# Altium project karmanDB_pcb.PrjPcb (part 2 of 3)

## Sheet karmanDB_power.SchDoc
size A
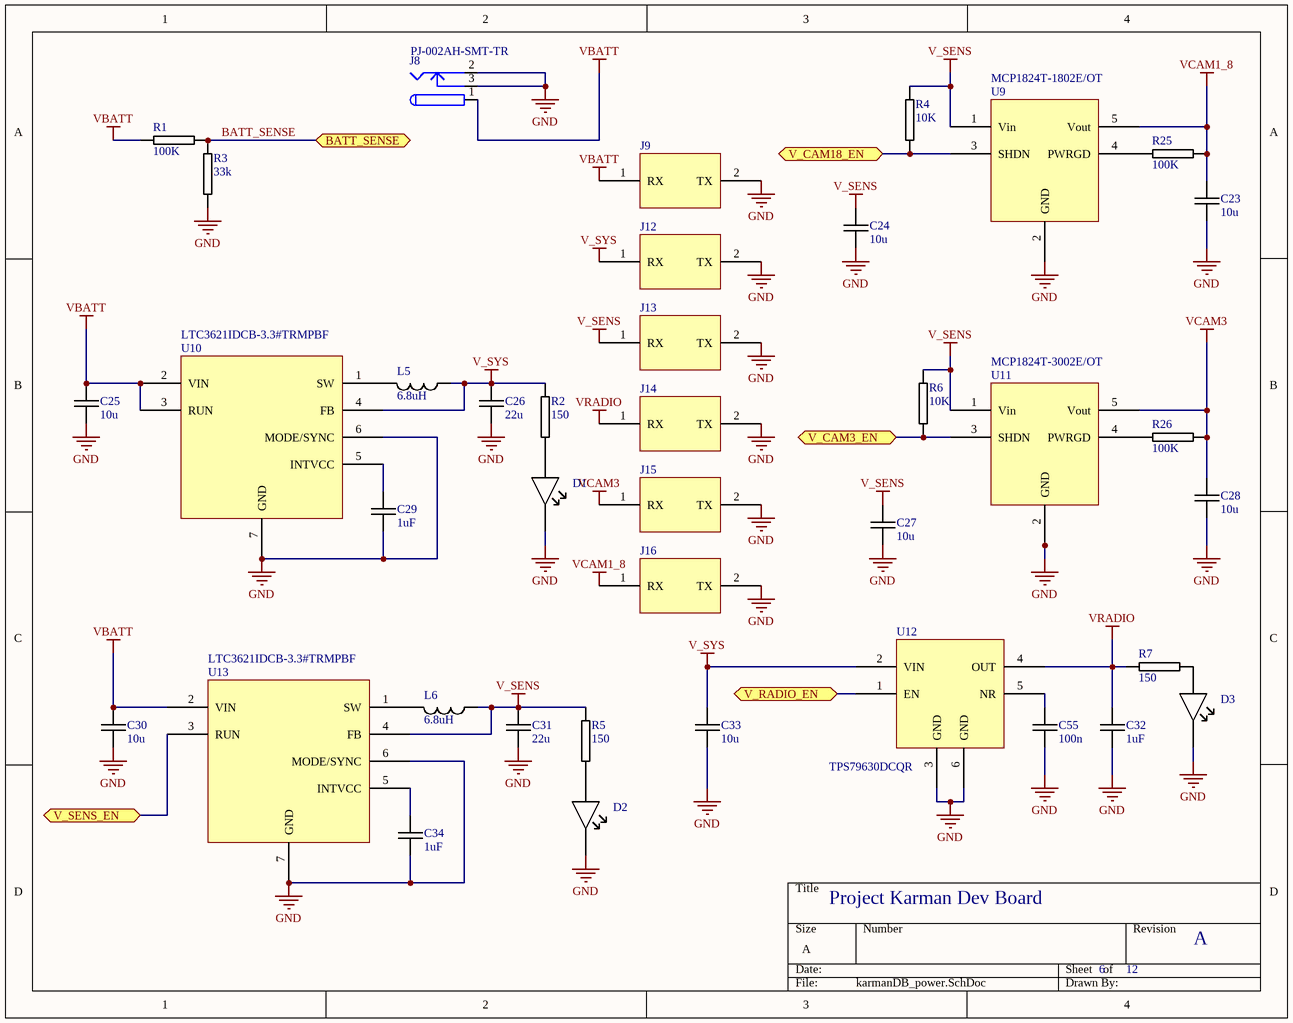
[diagram p4: karmanDB_power.SchDoc]

### Parts
C23  10u  [MURATA_GRM_0603]
C24  10u  [MURATA_GRM_0603]
C25  10u  [MURATA_GRM_0603]
C26  22u  [MURATA_GRM_0603]
C27  10u  [MURATA_GRM_0603]
C28  10u  [MURATA_GRM_0603]
C29  1uF  [MURATA_GRM_0402]
C30  10u  [MURATA_GRM_0603]
C31  22u  [MURATA_GRM_0603]
C32  1uF  [MURATA_GRM_0402]
C33  10u  [MURATA_GRM_0603]
C34  1uF  [MURATA_GRM_0402]
C55  100n  [MURATA_GRM_0603]
D1  LED_LITEON_LTST-C150CKT  [LITEON_LTST-C150]  (value not drawn)
D2  LED_LITEON_LTST-C150CKT  [LITEON_LTST-C150]  (value not drawn)
D3  LED_LITEON_LTST-C150CKT  [LITEON_LTST-C150]  (value not drawn)
J8  PJ-002AH-SMT-TR  [PJ-002AH-SMT]
J9  961102-6404-AR  [3M_961102-6X04]  (value not drawn)
J12  961102-6404-AR  [3M_961102-6X04]  (value not drawn)
J13  961102-6404-AR  [3M_961102-6X04]  (value not drawn)
J14  961102-6404-AR  [3M_961102-6X04]  (value not drawn)
J15  961102-6404-AR  [3M_961102-6X04]  (value not drawn)
J16  961102-6404-AR  [3M_961102-6X04]  (value not drawn)
L5  6.8uH  [TDK_RLF7030]
L6  6.8uH  [TDK_RLF7030]
R1  100K  [PANASONIC_ERJ3R]
R2  150  [PANASONIC_ERJ3R]
R3  33k  [PANASONIC_ERJ2R_SERIES]
R4  10K  [PANASONIC_ERJ3R]
R5  150  [PANASONIC_ERJ3R]
R6  10K  [PANASONIC_ERJ3R]
R7  150  [PANASONIC_ERJ3R]
R25  100K  [PANASONIC_ERJ3R]
R26  100K  [PANASONIC_ERJ3R]
U9  MCP1824T-1802E/OT  [26-27 MCP1824T(-3002E/OT)(-1802E/OT)]
U10  LTC3621IDCB-3.3#TRMPBF  [29 LTC3621IDCB-3.3]
U11  MCP1824T-3002E/OT  [26-27 MCP1824T(-3002E/OT)(-1802E/OT)]
U12  TPS79630DCQR  [TPS79630]
U13  LTC3621IDCB-3.3#TRMPBF  [29 LTC3621IDCB-3.3]

### Ports
BATT_SENSE (bidir), V_CAM3_EN (bidir), V_CAM18_EN (bidir), V_RADIO_EN (bidir), V_SENS_EN (bidir)

### Nets
GND: C23.2 C24.2 C25.2 C26.2 C27.2 C28.2 C29.2 C30.2 C31.2 C32.2 C33.2 C34.2 C55.2 D1.K D2.K D3.K J8.2 J8.3 J9.2(TX) J12.2(TX) J13.2(TX) J14.2(TX) J15.2(TX) J16.2(TX) R3.2 U9.2(GND) U10.6(MODE/SYNC) U10.7(GND) U11.2(GND) U12.3(GND) U12.6(GND) U13.6(MODE/SYNC) U13.7(GND)
V_SENS: C24.1 C27.1 C31.1 J13.1(RX) L6.1 R4.1 R5.1 R6.1 U9.1(Vin) U11.1(Vin) U13.4(FB)
V_SYS: C26.1 C33.1 J12.1(RX) L5.1 R2.2 U10.4(FB) U12.2(VIN)
VBATT: C25.1 C30.1 J8.1 J9.1(RX) R1.1 U10.2(VIN) U10.3(RUN) U13.2(VIN)
VCAM1_8: C23.1 J16.1(RX) R25.2 U9.5(Vout)
VCAM3: C28.1 J15.1(RX) R26.2 U11.5(Vout)
VRADIO: C32.1 J14.1(RX) R7.1 U12.4(OUT)
BATT_SENSE: R1.2 R3.1 ; port BATT_SENSE
V_CAM3_EN: R6.2 U11.3(SHDN) ; port V_CAM3_EN
V_CAM18_EN: R4.2 U9.3(SHDN) ; port V_CAM18_EN
V_RADIO_EN: U12.1(EN) ; port V_RADIO_EN
V_SENS_EN: U13.3(RUN) ; port V_SENS_EN
NetC29_1: C29.1 U10.5(INTVCC)
NetC34_1: C34.1 U13.5(INTVCC)
NetC55_1: C55.1 U12.5(NR)
NetD1_A: D1.A R2.1
NetD2_A: D2.A R5.2
NetD3_A: D3.A R7.2
NetL5_2: L5.2 U10.1(SW)
NetL6_2: L6.2 U13.1(SW)
NetR25_1: R25.1 U9.4(PWRGD)
NetR26_1: R26.1 U11.4(PWRGD)

### Notes on the sheet
- Project Karman Dev Board
- 6
- 12
- A

### Library data of the parts
C23-C25 C27 C28 C30 C33 = CAP_MURATA_GRM188R60J106: CAP CER 10UF 6.3V 20% X5R 0603; Manufacturer: Murata Electronics North America; Manufacturer Part Number: GRM188R60J106ME47J; Capacitance: 10µF; Supplier 1: Digi-Key; Supplier Part Number 1: 490-6405-1-ND; RoHS: RoHS Compliant; Category: Capacitors; Stock 1: 159118; Pricing: 1=0.19, 10=0.128, 50=0.0776, 100=0.0651, 250=0.05272, 500=0.0465, 1000=0.03953, 5000=0.03333 (USD); Packaging: Cut Tape (CT); Tolerance: ±20%; Voltage - Rated: 6.3V; Temperature Coefficient: X5R; Mounting Type: Surface Mount, MLCC; Operating Temperature: -55°C ~ 85°C; Applications: General Purpose; Ratings: -; Package / Case: 0603 (1608 Metric); Size / Dimension: 0.063" L x 0.031" W (1.60mm x 0.80mm); Height - Seated (Max): -; Thickness (Max): 0.035" (0.90mm); Lead Spacing: -; Features: -; Lead Style: -; ComponentLink1URL: http://www.murata.com/~/media/webrenewal/support/library/catalog/products/capacitor/mlcc/c02e.ashx; ComponentLink1Description: http://www.murata.com/~/media/webrenewal/support/library/catalog/products/capacitor/mlcc/c02e.ashx
C26 C31 = CAP_MURATA_GRM188R61A226ME15D: CAP CER 22UF 10V 20% X5R 0603; Manufacturer: Murata Electronics North America; Capacitance: 22µF; Supplier 1: Digi-Key; Supplier Part Number 1: 490-10476-1-ND; Manufacturer Part Number: GRM188R61A226ME15D; RoHS: RoHS Compliant; Category: Capacitors; Stock 1: 2895; Pricing: 1=0.3, 10=0.249, 25=0.1712, 50=0.14, 100=0.1244, 250=0.09332, 500=0.08242, 1000=0.07309 (USD); Packaging: Cut Tape (CT); Tolerance: ±20%; Voltage - Rated: 10V; Temperature Coefficient: X5R; Mounting Type: Surface Mount, MLCC; Operating Temperature: -55°C ~ 85°C; Applications: General Purpose; Ratings: -; Package / Case: 0603 (1608 Metric); Size / Dimension: 0.063" L x 0.031" W (1.60mm x 0.80mm); Height - Seated (Max): -; Thickness (Max): 0.039" (1.00mm); Lead Spacing: -; Features: -; Lead Style: -; ComponentLink1URL: http://www.murata.com/~/media/webrenewal/support/library/catalog/products/capacitor/mlcc/c02e.ashx; ComponentLink1Description: http://www.murata.com/~/media/webrenewal/support/library/catalog/products/capacitor/mlcc/c02e.ashx
C29 C32 C34 = CAP_MURATA_GRM155R61A105KE15D: CAP CER 1uF 10volts X5R 10% 0402; Manufacturer: Murata Electronics; Type: General Purpose MLCC; Voltage Rating DC: 10 V; Supplier 1: Mouser; Manufacturer Part Number: GRM155R61A105KE15D; RoHS: RoHS Compliant; Category: Multilayer Ceramic Capacitors MLCC - SMD/SMT; Stock 1: 726006; Pricing 1: 1=0.528, 10=0.066, 100=0.038, 1000=0.030, 2500=0.026, 10000=0.021, 20000=0.019, 50000=0.016, 100000=0.014 (AUD); Capacitance: 1 uF; Height: 0.5 mm; Length: 1 mm; Package / Case: 0402 (1005 metric); Packaging: Reel; Product: General Type MLCCs; Series: GRM; Termination Style: SMD/SMT; Tolerance: 10 %; Width: 0.5 mm; Brand: Murata Electronics; Case Code - in: 0402; Case Code - mm: 1005; Dielectric: X5R; Maximum Operating Temperature: + 85 C; Minimum Operating Temperature: - 55 C; Product Category: High Capacitance SMD Ceramic Chip Capacitors; Standard Pack Qty: 10000; RoHS - Mouser: Y; Minimum Order Quantity: 1; Reeling: True; ComponentLink1URL: http://www.mouser.com/ds/2/281/c02e-2905.pdf; ComponentLink1Description: http://www.mouser.com/ds/2/281/c02e-2905.pdf; Supplier Part Number 1: 81-GRM155R61A105KE15
C55 = CAP_MURATA_GRM188R70J104KA01D: CAP CER 0.1UF 6.3V 10% X7R 0603; Manufacturer: Murata Electronics North America; Capacitance: 0.1µF; Supplier 1: Digi-Key; Supplier Part Number 1: 490-9730-1-ND; Manufacturer Part Number: GRM188R70J104KA01D; RoHS: RoHS Compliant; Category: Capacitors; Stock 1: 25826; Pricing: 1=0.1, 10=0.061, 50=0.0332, 100=0.0281, 250=0.02296, 500=0.01964, 1000=0.0153 (USD); Packaging: Cut Tape (CT); Tolerance: ±10%; Voltage - Rated: 6.3V; Temperature Coefficient: X7R; Mounting Type: Surface Mount, MLCC; Operating Temperature: -55°C ~ 125°C; Applications: General Purpose; Ratings: -; Package / Case: 0603 (1608 Metric); Size / Dimension: 0.063" L x 0.031" W (1.60mm x 0.80mm); Height - Seated (Max): -; Thickness (Max): 0.035" (0.90mm); Lead Spacing: -; Features: -; Lead Style: -; ComponentLink1URL: http://www.murata.com/~/media/webrenewal/support/library/catalog/products/capacitor/mlcc/c02e.ashx; ComponentLink1Description: http://www.murata.com/~/media/webrenewal/support/library/catalog/products/capacitor/mlcc/c02e.ashx
D1-D3 = LED_LITEON_LTST-C150CKT: LED RED CLEAR 1206 SMD; Manufacturer: Lite-On Inc; Wavelength - Dominant: 638nm; Wavelength - Peak: 660nm; Millicandela Rating: 10mcd; Voltage - Forward (Vf) (Typ): 1.8V; Current - Test: 10mA; Viewing Angle: 130°; Lens Color: Colorless; Lens Style/Size: Rectangle with Flat Top, 2.06mm x 1.60mm; Supplier 1: Digi-Key; Supplier Part Number 1: 160-1167-1-ND; Manufacturer Part Number: LTST-C150CKT; RoHS: RoHS Compliant; Category: Optoelectronics; Stock 1: 90600; Pricing: 1=0.4, 10=0.297, 100=0.1574, 250=0.11136, 500=0.09504, 1000=0.07425 (USD); Packaging: Cut Tape (CT); Color: Red; Lens Transparency: Clear; Package / Case: 1206 (3216 Metric); Supplier Device Package: 1206; Size / Dimension: 3.20mm L x 1.60mm W; Height (Max): 1.10mm; Mounting Type: Surface Mount; ComponentLink1URL: http://optoelectronics.liteon.com/upload/download/DS-22-98-0002/S_110_LTST-C150CKT.pdf; ComponentLink1Description: http://optoelectronics.liteon.com/upload/download/DS-22-98-0002/S_110_LTST-C150CKT.pdf
J8 = PJ-002AH-SMT-TR: CONN POWER JACK 2.1X5.5MM HI CUR; Manufacturer: CUI Inc.; Gender: Male; Plug/Mating Plug Diameter: 2.1mm ID, 5.5mm OD; Number of Positions/Contacts: 2 Conductors, 3 Contacts; Internal Switch(s): Single Switch, Normally Closed; Shielding: Unshielded; Voltage - Rated: 24VDC; Current Rating: 5A; Supplier 1: Digi-Key; Manufacturer Part Number: PJ-002AH-SMT-TR; RoHS: RoHS Compliant; Category: Connectors, Interconnects; Stock 1: 15720; Pricing 1: 1=1.89, 10=1.469, 100=1.121 (USD); Connector Type: Jack; Mounting Type: Surface Mount; Termination: Solder; Features: -; Color: Black; Contact Material: Copper Alloy; Contact Material - Plating: Nickel; Housing Color: Black; Housing Material: Thermoplastic; Operating Temperature: -25°C ~ 85°C; ComponentLink1URL: http://www.cui.com/product/resource/digikeypdf/pj-002ah-smt.pdf; ComponentLink1Description: http://www.cui.com/product/resource/digikeypdf/pj-002ah-smt.pdf; Supplier Part Number 1: CP-002AHPJCT-ND
J9 J12-J16 = 961102-6404-AR: CONN HEADER VERT SGL 2POS GOLD; Manufacturer: 3M; Connector Type: Header, Unshrouded; Number of Positions: 2; Number of Positions Loaded: All; Pitch: 0.100" (2.54mm); Supplier 1: Digi-Key; Manufacturer Part Number: 961102-6404-AR; RoHS: RoHS Compliant; Category: Connectors, Interconnects; Stock 1: 60000; Pricing 1: 1=0.16, 10=0.15, 25=0.128, 50=0.112, 100=0.104, 250=0.092, 500=0.088, 1000=0.072, 2500=0.066 (USD); Packaging: Bulk; Contact Type: Male Pin; Number of Rows: 1; Row Spacing: -; Contact Mating Length: 0.217" (5.50mm); Mounting Type: Through Hole; Termination: Solder; Fastening Type: -; Features: -; Contact Finish: Gold; Contact Finish Thickness: Flash; Color: Black; ComponentLink1URL: http://multimedia.3m.com/mws/mediawebserver?66666UuZjcFSLXTtNxTElX&VEVuQEcuZgVs6EVs6E666666--; ComponentLink1Description: http://multimedia.3m.com/mws/mediawebserver?66666UuZjcFSLXTtNxTElX&VEVuQEcuZgVs6EVs6E666666--; Supplier Part Number 1: 3M9447-ND
L5 L6 = TDK_IND_RLF7030T-6R8M2R8: FIXED IND 6.8UH 2.8A 37.3 MOHM; Manufacturer: TDK Corporation; Type: Wirewound; Material - Core: Ferrite; Inductance: 6.8µH; Tolerance: ±20%; Current - Saturation: 3A; Shielding: Shielded; DC Resistance (DCR): 44.76 mOhm Max; Frequency - Test: 100kHz; Supplier 1: Digi-Key; Manufacturer Part Number: RLF7030T-6R8M2R8; RoHS: RoHS Compliant; Category: Inductors, Coils, Chokes; Stock 1: 8675; Pricing 1: 1=2.31, 10=2.153, 50=1.7528, 100=1.599, 500=1.353 (USD); Packaging: Cut Tape (CT); Current Rating: 2.8A; Q @ Freq: -; Frequency - Self Resonant: -; Operating Temperature: -40°C ~ 125°C; Mounting Type: Surface Mount; Package / Case: Nonstandard; Size / Dimension: 0.287" L x 0.268" W (7.30mm x 6.80mm); Height - Seated (Max): 0.126" (3.20mm); Supplier Device Package: -; ComponentLink1URL: http://product.tdk.com/inductor/ind/en/documents/inductor_commercial_power_rlf_en.pdf; ComponentLink1Description: http://product.tdk.com/inductor/ind/en/documents/inductor_commercial_power_rlf_en.pdf; Supplier Part Number 1: 445-2965-1-ND
R1 R25 R26 = RES_PANASONIC_ERJ-3GEYJ104V: RES SMD 100K OHM 5% 1/10W 0603; Manufacturer: Panasonic Electronic Components; Power (Watts): 0.1W, 1/10W; Temperature Coefficient: ±200ppm/°C; Supplier 1: Digi-Key; Supplier Part Number 1: P100KGCT-ND; Manufacturer Part Number: ERJ-3GEYJ104V; RoHS: RoHS Compliant; Category: Resistors; Stock 1: 1746081; Pricing: 1=0.1, 50=0.0096, 100=0.0071, 250=0.00544, 500=0.00436, 1000=0.00321 (USD); Packaging: Cut Tape (CT); Resistance (Ohms): 100k; Tolerance: ±5%; Composition: Thick Film; Features: Automotive AEC-Q200; Operating Temperature: -55°C ~ 155°C; Package / Case: 0603 (1608 Metric); Supplier Device Package: 0603; Size / Dimension: 0.063" L x 0.031" W (1.60mm x 0.80mm); Height: 0.022" (0.55mm); Number of Terminations: 2; ComponentLink1URL: http://industrial.panasonic.com/www-cgi/jvcr13pz.cgi?E+PZ+3+AOA0001+ERJ3GEYJ104V+7+WW; ComponentLink1Description: http://industrial.panasonic.com/www-cgi/jvcr13pz.cgi?E+PZ+3+AOA0001+ERJ3GEYJ104V+7+WW
R2 R5 R7 = RES_PANASONIC_ERJ-3GEYJ151V: RES SMD 150 OHM 5% 1/10W 0603; Manufacturer: Panasonic Electronic Components; Power (Watts): 0.1W, 1/10W; Temperature Coefficient: ±200ppm/°C; Supplier 1: Digi-Key; Supplier Part Number 1: P150GCT-ND; Manufacturer Part Number: ERJ-3GEYJ151V; RoHS: RoHS Compliant; Category: Resistors; Stock 1: 236723; Pricing: 1=0.1, 50=0.0096, 100=0.0071, 250=0.00544, 500=0.00436, 1000=0.00321 (USD); Packaging: Cut Tape (CT); Resistance (Ohms): 150; Tolerance: ±5%; Composition: Thick Film; Features: Automotive AEC-Q200; Operating Temperature: -55°C ~ 155°C; Package / Case: 0603 (1608 Metric); Supplier Device Package: 0603; Size / Dimension: 0.063" L x 0.031" W (1.60mm x 0.80mm); Height: 0.022" (0.55mm); Number of Terminations: 2; ComponentLink1URL: http://industrial.panasonic.com/www-cgi/jvcr13pz.cgi?E+PZ+3+AOA0001+ERJ3GEYJ151V+7+WW; ComponentLink1Description: http://industrial.panasonic.com/www-cgi/jvcr13pz.cgi?E+PZ+3+AOA0001+ERJ3GEYJ151V+7+WW
R3 = RES_PANASONIC_ERJ-2GEJ333X: RES SMD 33K OHM 5% 1/10W 0402; Manufacturer: Panasonic Electronic Components; Power (Watts): 0.1W, 1/10W; Temperature Coefficient: ±200ppm/°C; Supplier 1: Digi-Key; Manufacturer Part Number: ERJ-2GEJ333X; RoHS: RoHS Compliant; Category: Resistors; Stock 1: 860000; Pricing 1: 10000=0.00198, 30000=0.00174, 50000=0.0016, 100000=0.00156 (USD); Packaging: Tape & Reel (TR); Resistance (Ohms): 33k; Tolerance: ±5%; Composition: Thick Film; Features: Automotive AEC-Q200; Operating Temperature: -55°C ~ 155°C; Package / Case: 0402 (1005 Metric); Supplier Device Package: 0402; Size / Dimension: 0.039" L x 0.020" W (1.00mm x 0.50mm); Height: 0.016" (0.40mm); Number of Terminations: 2; ComponentLink1URL: http://industrial.panasonic.com/www-cgi/jvcr13pz.cgi?E+PZ+3+AOA0001+ERJ2GEJ333X+7+WW; ComponentLink1Description: http://industrial.panasonic.com/www-cgi/jvcr13pz.cgi?E+PZ+3+AOA0001+ERJ2GEJ333X+7+WW; Supplier Part Number 1: P33KJTR-ND
R4 R6 = RES_PANASONIC_ERJ-3GEYJ103V: RES SMD 10K OHM 5% 1/10W 0603; Manufacturer: Panasonic Electronic Components; Power (Watts): 0.1W, 1/10W; Temperature Coefficient: ±200ppm/°C; Supplier 1: Digi-Key; Supplier Part Number 1: P10KGCT-ND; Manufacturer Part Number: ERJ-3GEYJ103V; RoHS: RoHS Compliant; Category: Resistors; Stock 1: 4229597; Pricing: 1=0.1, 50=0.0096, 100=0.0071, 250=0.00544, 500=0.00436, 1000=0.00321 (USD); Packaging: Cut Tape (CT); Resistance (Ohms): 10k; Tolerance: ±5%; Composition: Thick Film; Features: Automotive AEC-Q200; Operating Temperature: -55°C ~ 155°C; Package / Case: 0603 (1608 Metric); Supplier Device Package: 0603; Size / Dimension: 0.063" L x 0.031" W (1.60mm x 0.80mm); Height: 0.022" (0.55mm); Number of Terminations: 2; ComponentLink1URL: http://industrial.panasonic.com/www-cgi/jvcr13pz.cgi?E+PZ+3+AOA0001+ERJ3GEYJ103V+7+WW; ComponentLink1Description: http://industrial.panasonic.com/www-cgi/jvcr13pz.cgi?E+PZ+3+AOA0001+ERJ3GEYJ103V+7+WW
U9 = MCP1824T-1802E/OT: IC REG LDO 1.8V 0.3A SOT23-5; Manufacturer: Microchip Technology; Regulator Topology: Positive Fixed; Current - Output: 300mA; Voltage - Dropout (Typical): 0.2V @ 300mA; Number of Regulators: 1; Voltage - Input: 2.1 V ~ 6 V; Supplier 1: Digi-Key; Manufacturer Part Number: MCP1824T-1802E/OT; RoHS: RoHS Compliant; Category: Integrated Circuits (ICs); Stock 1: 10644; Pricing 1: 1=0.5, 10=0.42, 25=0.35, 100=0.32 (USD); Packaging: Cut Tape (CT); Voltage - Output: 1.8V; Current - Limit (Min): -; Operating Temperature: -40°C ~ 125°C; Mounting Type: Surface Mount; Package / Case: SC-74A, SOT-753; Supplier Device Package: SOT-23-5; ComponentLink1URL: http://www.microchip.com/mymicrochip/filehandler.aspx?ddocname=en533257; ComponentLink1Description: http://www.microchip.com/mymicrochip/filehandler.aspx?ddocname=en533257; Supplier Part Number 1: MCP1824T-1802E/OTCT-ND
U10 U13 = LTC3621IDCB-3.3#TRMPBF: IC REG BUCK 3.3V 1A SYNC 6DFN; Manufacturer: Linear Technology; Function: Step-Down; Output Configuration: Positive; Output Type: Fixed; Number of Outputs: 1; Voltage - Input (Min): 2.7V; Voltage - Input (Max): 17V; Frequency - Switching: 1MHz; Synchronous Rectifier: Yes; Supplier 1: Digi-Key; Manufacturer Part Number: LTC3621IDCB-3.3#TRMPBF; RoHS: RoHS Compliant; Category: Integrated Circuits (ICs); Stock 1: 490; Pricing 1: 1=6.84, 25=6.1052, 100=5.4948 (USD); Packaging: Cut Tape (CT); Topology: Buck; Voltage - Output (Min/Fixed): 3.3V; Voltage - Output (Max): -; Current - Output: 1A; Operating Temperature: -40°C ~ 125°C (TJ); Mounting Type: Surface Mount; Package / Case: 6-WFDFN Exposed Pad; Supplier Device Package: 6-DFN (2x3); ComponentLink1URL: http://www.linear.com/docs/42954; ComponentLink1Description: http://www.linear.com/docs/42954; Supplier Part Number 1: LTC3621IDCB-3.3#TRMPBFCT-ND
U11 = MCP1824T-3002E/OT: IC REG LDO 3V 0.3A SOT23-5; Manufacturer: Microchip Technology; Regulator Topology: Positive Fixed; Current - Output: 300mA; Voltage - Dropout (Typical): 0.2V @ 300mA; Number of Regulators: 1; Voltage - Input: Up to 6V; Supplier 1: Digi-Key; Manufacturer Part Number: MCP1824T-3002E/OT; RoHS: RoHS Compliant; Category: Integrated Circuits (ICs); Stock 1: 1155; Pricing 1: 1=0.5, 10=0.42, 25=0.35, 100=0.32 (USD); Packaging: Cut Tape (CT); Voltage - Output: 3V; Current - Limit (Min): -; Operating Temperature: -40°C ~ 125°C; Mounting Type: Surface Mount; Package / Case: SC-74A, SOT-753; Supplier Device Package: SOT-23-5; ComponentLink1URL: http://www.microchip.com/mymicrochip/filehandler.aspx?ddocname=en533257; ComponentLink1Description: http://www.microchip.com/mymicrochip/filehandler.aspx?ddocname=en533257; Supplier Part Number 1: MCP1824T-3002E/OTCT-ND
U12 = TPS79630DCQR: IC REG LDO 3V 1A SOT223-6; Manufacturer: Texas Instruments; Regulator Topology: Positive Fixed; Voltage - Dropout (Typical): 0.25V @ 1A; Number of Regulators: 1; Voltage - Input: Up to 5.5V; Current - Limit (Min): 2.4A; Supplier 1: Digi-Key; Manufacturer Part Number: TPS79630DCQR; RoHS: RoHS Compliant; Category: Integrated Circuits (ICs); Stock 1: 4641; Pricing 1: 1=3.13, 10=2.825, 25=2.5308, 100=2.2759, 250=2.02088, 500=1.7658, 750=1.59903, 1000=1.22625 (USD); Packaging: Cut Tape (CT); Voltage - Output: 3V; Current - Output: 1A; Operating Temperature: -40°C ~ 125°C; Mounting Type: Surface Mount; Package / Case: SOT-223-6; Supplier Device Package: SOT-223-6; ComponentLink1URL: http://www.ti.com/lit/ds/symlink/tps796.pdf; ComponentLink1Description: http://www.ti.com/lit/ds/symlink/tps796.pdf; Supplier Part Number 1: 296-13765-1-ND

## Sheet karmanDB_transceiver.SchDoc
size A
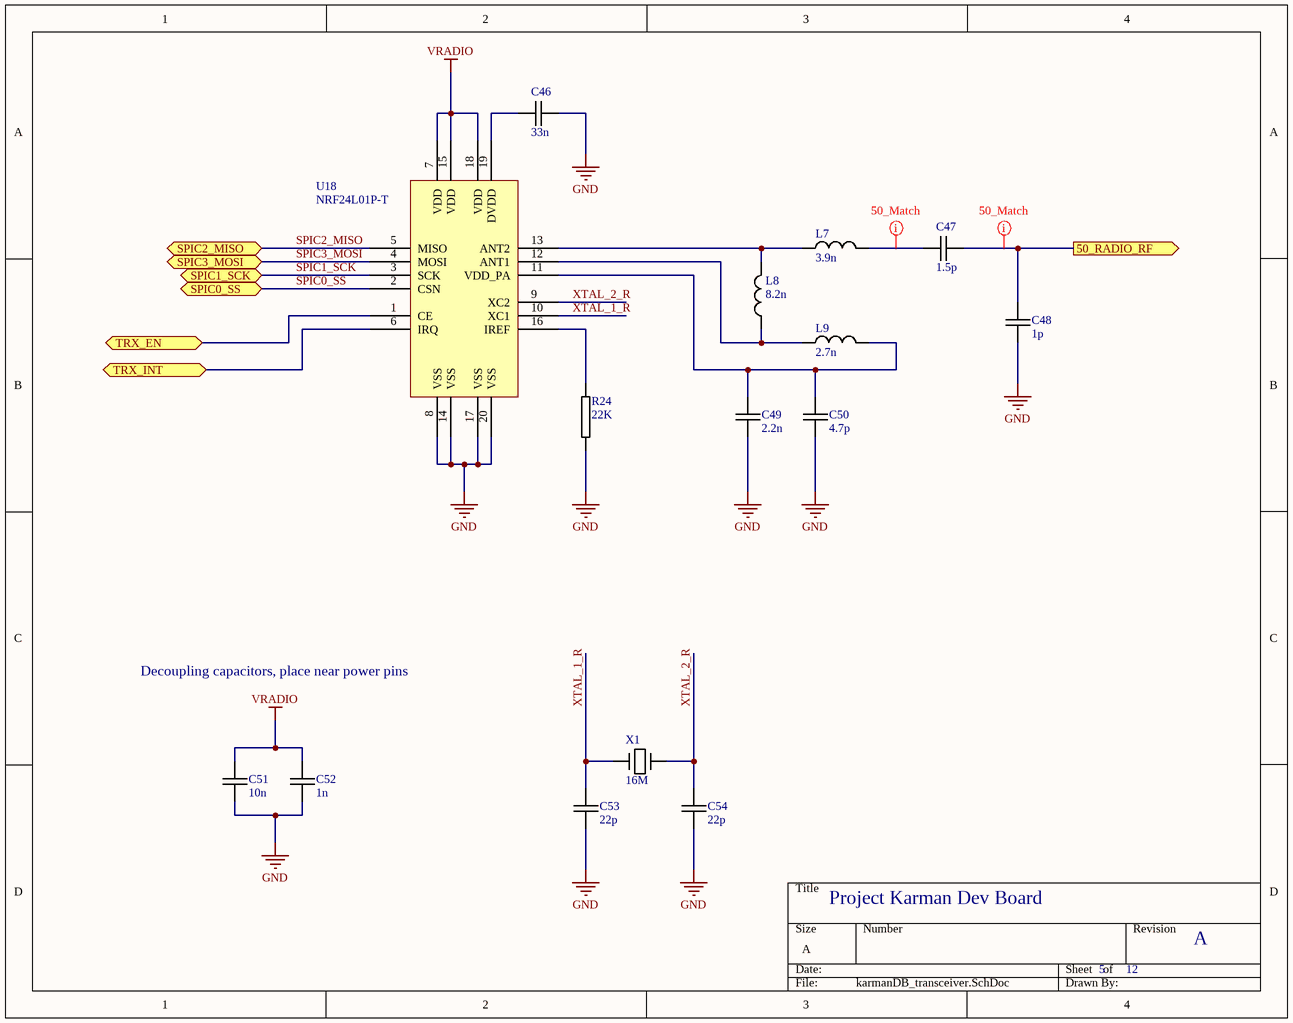
[diagram p5: karmanDB_transceiver.SchDoc]

### Parts
C46  33n  [MURATA_GRM_0603]
C47  1.5p  [MURATA_GRM_0402]
C48  1p  [MURATA_GRM_0402]
C49  2.2n  [MURATA_GRM_0402]
C50  4.7p  [MURATA_GRM_0402]
C51  10n  [MURATA_GRM_0603]
C52  1n  [MURATA_GRM_0603]
C53  22p  [MURATA_GRM_0603]
C54  22p  [MURATA_GRM_0603]
L7  3.9n  [PANASONIC_ELJRF]
L8  8.2n  [PANASONIC_ELJRF]
L9  2.7n  [PANASONIC_ELJRF]
R24  22K  [PANASONIC_ERJ3R]
U18  Manufacturer Part Number: NRF24L01P-T  [NORDIC_nRF24L01P]  (hidden comment: NORDIC_NRF24L01P)
X1  16M  [TXC_7B_SERIES]

### Ports
50_RADIO_RF (out), SPIC0_SS (bidir), SPIC1_SCK (bidir), SPIC2_MISO (bidir), SPIC3_MOSI (bidir), TRX_EN (bidir), TRX_INT (bidir)

### Nets
GND: C46.2 C48.2 C49.2 C50.2 C51.2 C52.2 C53.2 C54.2 R24.2 U18.8(VSS) U18.14(VSS) U18.17(VSS) U18.20(VSS) X1.PAD
VRADIO: C51.1 C52.1 U18.7(VDD) U18.15(VDD) U18.18(VDD)
SPIC0_SS: U18.2(CSN) ; port SPIC0_SS
SPIC1_SCK: U18.3(SCK) ; port SPIC1_SCK
SPIC2_MISO: U18.5(MISO) ; port SPIC2_MISO
SPIC3_MOSI: U18.4(MOSI) ; port SPIC3_MOSI
TRX_EN: U18.1(CE) ; port TRX_EN
TRX_INT: U18.6(IRQ) ; port TRX_INT
XTAL_1_R: C53.1 U18.10(XC1) X1.XTAL_P
XTAL_2_R: C54.1 U18.9(XC2) X1.XTAL_N
NetC46_1: C46.1 U18.19(DVDD)
NetC47_1: C47.1 L7.2
NetC47_2: C47.2 C48.1 ; port 50_RADIO_RF
NetC49_1: C49.1 C50.1 L9.2 U18.11(VDD_PA)
NetL7_1: L7.1 L8.2 U18.13(ANT2)
NetL8_1: L8.1 L9.1 U18.12(ANT1)
NetR24_1: R24.1 U18.16(IREF)

### Layout directives
net class 50_Match_Class: NetC47_1, NetC47_2

### Notes on the sheet
- Decoupling capacitors, place near power pins
- Project Karman Dev Board
- 5
- 12
- A

### Library data of the parts
C46 = CAP_MURATA_GRM188R71C333KA01D: CAP CER 0.033UF 16V 10% X7R 0603; Manufacturer: Murata Electronics North America; Capacitance: 0.033µF; Supplier 1: Digi-Key; Supplier Part Number 1: 490-1528-1-ND; Manufacturer Part Number: GRM188R71C333KA01D; RoHS: RoHS Compliant; Category: Capacitors; Stock 1: 112656; Pricing: 1=0.1, 10=0.054, 50=0.0292, 100=0.0248, 250=0.02024, 500=0.01732, 1000=0.0135 (USD); Packaging: Cut Tape (CT); Tolerance: ±10%; Voltage - Rated: 16V; Temperature Coefficient: X7R; Mounting Type: Surface Mount, MLCC; Operating Temperature: -55°C ~ 125°C; Applications: General Purpose; Ratings: -; Package / Case: 0603 (1608 Metric); Size / Dimension: 0.063" L x 0.031" W (1.60mm x 0.80mm); Height - Seated (Max): -; Thickness (Max): 0.035" (0.90mm); Lead Spacing: -; Features: -; Lead Style: -; ComponentLink1URL: http://www.murata.com/~/media/webrenewal/support/library/catalog/products/capacitor/mlcc/c02e.ashx; ComponentLink1Description: http://www.murata.com/~/media/webrenewal/support/library/catalog/products/capacitor/mlcc/c02e.ashx
C47 = CAP_MURATA_GJM1555C1H1R5BB01D: CAP CER 1.5PF 50V NP0 0402; Manufacturer: Murata Electronics North America; Tolerance: ±0.1pF; Temperature Coefficient: C0G, NP0; Supplier 1: Digi-Key; Supplier Part Number 1: 490-8087-1-ND; Manufacturer Part Number: GJM1555C1H1R5BB01D; RoHS: RoHS Compliant; Category: Capacitors; Stock 1: 3662; Pricing: 1=0.2, 10=0.14, 50=0.0804, 100=0.0664, 250=0.05588, 500=0.04682, 1000=0.03768, 5000=0.03185 (USD); Packaging: Cut Tape (CT); Capacitance: 1.5pF; Voltage - Rated: 50V; Mounting Type: Surface Mount, MLCC; Operating Temperature: -55°C ~ 125°C; Applications: RF, Microwave, High Frequency; Ratings: -; Package / Case: 0402 (1005 Metric); Size / Dimension: 0.039" L x 0.020" W (1.00mm x 0.50mm); Height - Seated (Max): -; Thickness (Max): 0.022" (0.55mm); Lead Spacing: -; Features: High Q, Low Loss; Lead Style: -; ComponentLink1URL: http://www.murata.com/~/media/webrenewal/support/library/catalog/products/capacitor/mlcc/c02e.ashx; ComponentLink1Description: http://www.murata.com/~/media/webrenewal/support/library/catalog/products/capacitor/mlcc/c02e.ashx
C48 = CAP_MURATA_GJM1555C1H1R0BB01D: CAP CER 1PF 50V NP0 0402; Manufacturer: Murata Electronics North America; Tolerance: ±0.1pF; Temperature Coefficient: C0G, NP0; Supplier 1: Digi-Key; Supplier Part Number 1: 490-6073-1-ND; Manufacturer Part Number: GJM1555C1H1R0BB01D; RoHS: RoHS Compliant; Category: Capacitors; Stock 1: 74934; Pricing: 1=0.2, 10=0.14, 25=0.1048, 50=0.0804, 100=0.0664, 250=0.05588, 500=0.04682, 1000=0.03768, 5000=0.03185 (USD); Packaging: Cut Tape (CT); Capacitance: 1pF; Voltage - Rated: 50V; Mounting Type: Surface Mount, MLCC; Operating Temperature: -55°C ~ 125°C; Applications: RF, Microwave, High Frequency; Ratings: -; Package / Case: 0402 (1005 Metric); Size / Dimension: 0.039" L x 0.020" W (1.00mm x 0.50mm); Height - Seated (Max): -; Thickness (Max): 0.022" (0.55mm); Lead Spacing: -; Features: High Q, Low Loss; Lead Style: -; ComponentLink1URL: http://www.murata.com/~/media/webrenewal/support/library/catalog/products/capacitor/mlcc/c02e.ashx; ComponentLink1Description: http://www.murata.com/~/media/webrenewal/support/library/catalog/products/capacitor/mlcc/c02e.ashx
C49 = MURATA_GRM155R71C222KA01D: CAP CER 2200PF 16V 10% X7R 0402; Manufacturer: Murata Electronics North America; Supplier 1: Digi-Key; Supplier Part Number 1: 490-6330-1-ND; Manufacturer Part Number: GRM155R71C222KA01D; RoHS: RoHS Compliant; Category: Capacitors; Stock 1: 28283; Pricing: 1=0.1, 10=0.023, 25=0.016, 50=0.0124, 100=0.0105, 250=0.00856, 500=0.00732, 1000=0.0057, 5000=0.00475 (USD); Packaging: Cut Tape (CT); Capacitance: 2200pF; Tolerance: ±10%; Voltage - Rated: 16V; Temperature Coefficient: X7R; Mounting Type: Surface Mount, MLCC; Operating Temperature: -55°C ~ 125°C; Applications: General Purpose; Ratings: -; Package / Case: 0402 (1005 Metric); Size / Dimension: 0.039" L x 0.020" W (1.00mm x 0.50mm); Height - Seated (Max): -; Thickness (Max): 0.022" (0.55mm); Lead Spacing: -; Features: -; Lead Style: *; ComponentLink1URL: http://www.murata.com/~/media/webrenewal/support/library/catalog/products/capacitor/mlcc/c02e.ashx; ComponentLink1Description: http://www.murata.com/~/media/webrenewal/support/library/catalog/products/capacitor/mlcc/c02e.ashx
C50 = MURATA_GRM1555C1H4R7CA01D: CAP CER 4.7PF 50V NP0 0402; Manufacturer: Murata Electronics North America; Tolerance: ±0.25pF; Temperature Coefficient: C0G, NP0; Supplier 1: Digi-Key; Supplier Part Number 1: 490-5874-1-ND; Manufacturer Part Number: GRM1555C1H4R7CA01D; RoHS: RoHS Compliant; Category: Capacitors; Stock 1: 317555; Pricing: 1=0.1, 10=0.021, 50=0.0114, 100=0.0096, 250=0.00788, 500=0.00674, 1000=0.00525, 5000=0.00438 (USD); Packaging: Cut Tape (CT); Capacitance: 4.7pF; Voltage - Rated: 50V; Mounting Type: Surface Mount, MLCC; Operating Temperature: -55°C ~ 125°C; Applications: General Purpose; Ratings: -; Package / Case: 0402 (1005 Metric); Size / Dimension: 0.039" L x 0.020" W (1.00mm x 0.50mm); Height - Seated (Max): -; Thickness (Max): 0.022" (0.55mm); Lead Spacing: -; Features: -; Lead Style: -; ComponentLink1URL: http://www.murata.com/~/media/webrenewal/support/library/catalog/products/capacitor/mlcc/c02e.ashx; ComponentLink1Description: http://www.murata.com/~/media/webrenewal/support/library/catalog/products/capacitor/mlcc/c02e.ashx
C51 = CAP_MURATA_GRM188R71H103MA01D: CAP CER 10000PF 50V 20% X7R 0603; Manufacturer: Murata Electronics North America; Supplier 1: Digi-Key; Supplier Part Number 1: 490-1511-1-ND; Manufacturer Part Number: GRM188R71H103MA01D; RoHS: RoHS Compliant; Category: Capacitors; Stock 1: 188245; Pricing: 1=0.1, 10=0.018, 50=0.0098, 100=0.0083, 250=0.00676, 500=0.00578, 1000=0.0045 (USD); Packaging: Cut Tape (CT); Capacitance: 10000pF; Tolerance: ±20%; Voltage - Rated: 50V; Temperature Coefficient: X7R; Mounting Type: Surface Mount, MLCC; Operating Temperature: -55°C ~ 125°C; Applications: General Purpose; Ratings: -; Package / Case: 0603 (1608 Metric); Size / Dimension: 0.063" L x 0.031" W (1.60mm x 0.80mm); Height - Seated (Max): -; Thickness (Max): 0.035" (0.90mm); Lead Spacing: -; Features: -; Lead Style: -; ComponentLink1URL: http://www.murata.com/~/media/webrenewal/support/library/catalog/products/capacitor/mlcc/c02e.ashx; ComponentLink1Description: http://www.murata.com/~/media/webrenewal/support/library/catalog/products/capacitor/mlcc/c02e.ashx
C52 = CAP_MURATA_GRM188R71H102KA01D: CAP CER 1000PF 50V 10% X7R 0603; Manufacturer: Murata Electronics North America; Supplier 1: Digi-Key; Supplier Part Number 1: 490-1494-1-ND; Manufacturer Part Number: GRM188R71H102KA01D; RoHS: RoHS Compliant; Category: Capacitors; Stock 1: 1211591; Pricing: 1=0.1, 10=0.02, 50=0.0108, 100=0.0091, 250=0.00744, 500=0.00636, 1000=0.00495 (USD); Packaging: Cut Tape (CT); Capacitance: 1000pF; Tolerance: ±10%; Voltage - Rated: 50V; Temperature Coefficient: X7R; Mounting Type: Surface Mount, MLCC; Operating Temperature: -55°C ~ 125°C; Applications: General Purpose; Ratings: -; Package / Case: 0603 (1608 Metric); Size / Dimension: 0.063" L x 0.031" W (1.60mm x 0.80mm); Height - Seated (Max): -; Thickness (Max): 0.035" (0.90mm); Lead Spacing: -; Features: -; Lead Style: -; ComponentLink1URL: http://www.murata.com/~/media/webrenewal/support/library/catalog/products/capacitor/mlcc/c02e.ashx; ComponentLink1Description: http://www.murata.com/~/media/webrenewal/support/library/catalog/products/capacitor/mlcc/c02e.ashx
C53 C54 = CAP_MURATA_GRM1885C1H220JA01D: CAP CER 22PF 50V 5% NP0 0603; Manufacturer: Murata Electronics North America; Temperature Coefficient: C0G, NP0; Supplier 1: Digi-Key; Supplier Part Number 1: 490-1411-1-ND; Manufacturer Part Number: GRM1885C1H220JA01D; RoHS: RoHS Compliant; Category: Capacitors; Stock 1: 287854; Pricing: 1=0.1, 10=0.041, 50=0.0222, 100=0.0188, 250=0.0154, 500=0.01316, 1000=0.01026 (USD); Packaging: Cut Tape (CT); Capacitance: 22pF; Tolerance: ±5%; Voltage - Rated: 50V; Mounting Type: Surface Mount, MLCC; Operating Temperature: -55°C ~ 125°C; Applications: General Purpose; Ratings: -; Package / Case: 0603 (1608 Metric); Size / Dimension: 0.063" L x 0.031" W (1.60mm x 0.80mm); Height - Seated (Max): -; Thickness (Max): 0.035" (0.90mm); Lead Spacing: -; Features: -; Lead Style: -; ComponentLink1URL: http://www.murata.com/~/media/webrenewal/support/library/catalog/products/capacitor/mlcc/c02e.ashx; ComponentLink1Description: http://www.murata.com/~/media/webrenewal/support/library/catalog/products/capacitor/mlcc/c02e.ashx
L7 = PANASONIC_ELJ-RF3N9DFB: FIXED IND 3.9NH 360MA 150 MOHM; Manufacturer: Panasonic Electronic Components; Type: Multilayer; Material - Core: Non-Magnetic; Tolerance: ±0.3nH; Shielding: Unshielded; DC Resistance (DCR): 150 mOhm Max; Q @ Freq: 8 @ 100MHz; Frequency - Self Resonant: 5.2GHz; Frequency - Test: 100MHz; Supplier 1: Digi-Key; Supplier Part Number 1: PCD1930CT-ND; Manufacturer Part Number: ELJ-RF3N9DFB; RoHS: RoHS Compliant; Category: Inductors, Coils, Chokes; Stock 1: 11359; Pricing: 1=0.08, 10=0.074, 50=0.0698, 100=0.0651, 500=0.05116 (USD); Packaging: Cut Tape (CT); Inductance: 3.9nH; Current Rating: 360mA; Current - Saturation: -; Operating Temperature: -20°C ~ 85°C; Mounting Type: Surface Mount; Package / Case: 0402 (1005 Metric); Size / Dimension: 0.040" L x 0.024" W (1.00mm x 0.50mm); Height - Seated (Max): 0.022" (0.55mm); Supplier Device Package: 0402 (1005 Metric); ComponentLink1URL: http://industrial.panasonic.com/www-cgi/jvcr13pz.cgi?E+PZ+3+AGA0024+ELJRF3N9DFB+7+WW; ComponentLink1Description: http://industrial.panasonic.com/www-cgi/jvcr13pz.cgi?E+PZ+3+AGA0024+ELJRF3N9DFB+7+WW
L8 = PANASONIC_ELJ-RF8N2JFB: FIXED IND 8.2NH 320MA 350 MOHM; Manufacturer: Panasonic Electronic Components; Type: Multilayer; Material - Core: Non-Magnetic; Tolerance: ±5%; Shielding: Unshielded; DC Resistance (DCR): 350 mOhm Max; Q @ Freq: 8 @ 100MHz; Frequency - Self Resonant: 3.5GHz; Frequency - Test: 100MHz; Supplier 1: Digi-Key; Supplier Part Number 1: PCD1934CT-ND; Manufacturer Part Number: ELJ-RF8N2JFB; RoHS: RoHS Compliant; Category: Inductors, Coils, Chokes; Stock 1: 26730; Pricing: 1=0.08, 10=0.074, 50=0.0698, 100=0.0651, 500=0.05116 (USD); Packaging: Cut Tape (CT); Inductance: 8.2nH; Current Rating: 320mA; Current - Saturation: -; Operating Temperature: -20°C ~ 85°C; Mounting Type: Surface Mount; Package / Case: 0402 (1005 Metric); Size / Dimension: 0.040" L x 0.024" W (1.00mm x 0.50mm); Height - Seated (Max): 0.022" (0.55mm); Supplier Device Package: 0402 (1005 Metric); ComponentLink1URL: http://industrial.panasonic.com/www-cgi/jvcr13pz.cgi?E+PZ+3+AGA0024+ELJRF8N2JFB+7+WW; ComponentLink1Description: http://industrial.panasonic.com/www-cgi/jvcr13pz.cgi?E+PZ+3+AGA0024+ELJRF8N2JFB+7+WW
L9 = PANASONIC_ELJ-RF2N7ZFB: FIXED IND 2.7NH 400MA 100 MOHM; Manufacturer: Panasonic Electronic Components; Type: Multilayer; Material - Core: Non-Magnetic; Tolerance: ±0.2nH; Shielding: Unshielded; DC Resistance (DCR): 100 mOhm Max; Q @ Freq: 8 @ 100MHz; Frequency - Self Resonant: 5.5GHz; Frequency - Test: 100MHz; Supplier 1: Digi-Key; Supplier Part Number 1: PCD1903CT-ND; Manufacturer Part Number: ELJ-RF2N7ZFB; RoHS: RoHS Compliant; Category: Inductors, Coils, Chokes; Stock 1: 8911; Pricing: 1=0.1, 10=0.097, 50=0.0908, 100=0.0847, 500=0.06656 (USD); Packaging: Cut Tape (CT); Inductance: 2.7nH; Current Rating: 400mA; Current - Saturation: -; Operating Temperature: -20°C ~ 85°C; Mounting Type: Surface Mount; Package / Case: 0402 (1005 Metric); Size / Dimension: 0.040" L x 0.024" W (1.00mm x 0.50mm); Height - Seated (Max): 0.022" (0.55mm); Supplier Device Package: 0402 (1005 Metric); ComponentLink1URL: http://industrial.panasonic.com/www-cgi/jvcr13pz.cgi?E+PZ+3+AGA0024+ELJRF2N7ZFB+7+WW; ComponentLink1Description: http://industrial.panasonic.com/www-cgi/jvcr13pz.cgi?E+PZ+3+AGA0024+ELJRF2N7ZFB+7+WW
R24 = RES_PANASONIC_ERJ-3EKF2202V: RES SMD 22K OHM 1% 1/10W 0603; Manufacturer: Panasonic Electronic Components; Power (Watts): 0.1W, 1/10W; Temperature Coefficient: ±100ppm/°C; Supplier 1: Digi-Key; Supplier Part Number 1: P22.0KHCT-ND; Manufacturer Part Number: ERJ-3EKF2202V; RoHS: RoHS Compliant; Category: Resistors; Stock 1: 17812; Pricing: 1=0.1, 50=0.0114, 100=0.0084, 250=0.00644, 500=0.00514, 1000=0.00379 (USD); Packaging: Cut Tape (CT); Resistance (Ohms): 22k; Tolerance: ±1%; Composition: Thick Film; Features: Automotive AEC-Q200; Operating Temperature: -55°C ~ 155°C; Package / Case: 0603 (1608 Metric); Supplier Device Package: 0603; Size / Dimension: 0.063" L x 0.031" W (1.60mm x 0.80mm); Height: 0.022" (0.55mm); Number of Terminations: 2; ComponentLink1URL: http://industrial.panasonic.com/www-cgi/jvcr13pz.cgi?E+PZ+3+AOA0002+ERJ3EKF2202V+7+WW; ComponentLink1Description: http://industrial.panasonic.com/www-cgi/jvcr13pz.cgi?E+PZ+3+AOA0002+ERJ3EKF2202V+7+WW
U18 = NORDIC_NRF24L01P: IC RF TRANSCEIVER 2.4GHZ 20QFN; Manufacturer: Nordic Semiconductor ASA; Data Rate (Max): 2Mbps; Modulation or Protocol: GFSK; Power - Output: 0dBm; Sensitivity: -94dBm; Voltage - Supply: 1.9 V ~ 3.6 V; Current - Receiving: 13.5mA; Current - Transmitting: 11.3mA; Data Interface: PCB, Surface Mount; Supplier 1: Digi-Key; Supplier Part Number 1: 1490-1019-ND; RoHS: RoHS Compliant; Category: RF/IF and RFID; Stock 1: 2933; Pricing: 1=3.39, 10=3.03, 50=2.727, 100=2.4846, 250=2.2422, 500=2.01192, 1000=1.6968, 2500=1.61196, 5000=1.5453 (USD); Packaging: Tray; Frequency: 2.4GHz; Applications: General Purpose; Memory Size: -; Antenna Connector: PCB, Surface Mount; Operating Temperature: -40°C ~ 85°C; Package / Case: 20-VFQFN Exposed Pad; ComponentLink1URL: http://www.nordicsemi.com/eng/content/download/2726/34069/file/nRF24L01P_Product_Specification_1_0.pdf; ComponentLink1Description: http://www.nordicsemi.com/eng/content/download/2726/34069/file/nRF24L01P_Product_Specification_1_0.pdf
X1 = CRYSTAL_TXC_7B-16.000MAAE-T: CRYSTAL 16.0000MHZ 12PF SMD; Manufacturer: TXC CORPORATION; Frequency: 16MHz; Frequency Stability: ±30ppm; ESR (Equivalent Series Resistance): 40 Ohm; Operating Mode: Fundamental; Supplier 1: Digi-Key; Supplier Part Number 1: 887-2358-1-ND; Manufacturer Part Number: 7B-16.000MAAE-T; RoHS: RoHS Compliant; Category: Crystals and Oscillators; Stock 1: 1169; Pricing: 1=0.71, 10=0.629, 50=0.5876, 100=0.52, 500=0.4914 (USD); Packaging: Cut Tape (CT); Type: MHz Crystal; Frequency Tolerance: ±30ppm; Load Capacitance: 12pF; Operating Temperature: -20°C ~ 70°C; Ratings: -; Mounting Type: Surface Mount; Package / Case: 4-SMD, No Lead (DFN, LCC); Size / Dimension: 0.197" L x 0.126" W (5.00mm x 3.20mm); Height: 0.041" (1.05mm); ComponentLink1URL: http://www.txccrystal.com/images/pdf/7b.pdf; ComponentLink1Description: http://www.txccrystal.com/images/pdf/7b.pdf

## Sheet karmanDB_mem.SchDoc
size A
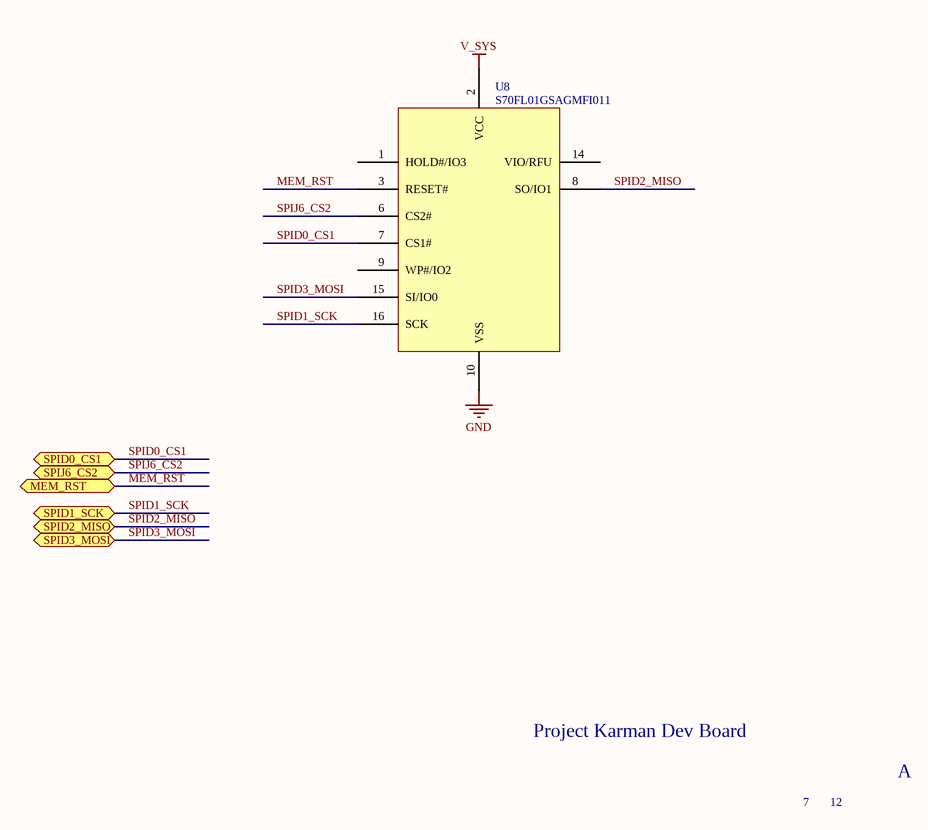
[diagram p6: karmanDB_mem.SchDoc]

### Parts
U8  S70FL01GSAGMFI011  [15 S70FL01GSAGMFI011]

### Ports
MEM_RST (bidir), SPID0_CS1 (bidir), SPID1_SCK (bidir), SPID2_MISO (bidir), SPID3_MOSI (bidir), SPIJ6_CS2 (bidir)

### Nets
GND: U8.10(VSS)
V_SYS: U8.2(VCC)
MEM_RST: U8.3(RESET#) ; port MEM_RST
SPID0_CS1: U8.7(CS1#) ; port SPID0_CS1
SPID1_SCK: U8.16(SCK) ; port SPID1_SCK
SPID2_MISO: U8.8(SO/IO1) ; port SPID2_MISO
SPID3_MOSI: U8.15(SI/IO0) ; port SPID3_MOSI
SPIJ6_CS2: U8.6(CS2#) ; port SPIJ6_CS2

Not connected (* = marked no-connect by the designer): U8 1(HOLD#/IO3) 9(WP#/IO2) 14(VIO/RFU)

### Notes on the sheet
- Project Karman Dev Board
- 7
- 12
- A

### Library data of the parts
U8 = S70FL01GSAGMFI011: IC FLASH 1GBIT 133MHZ 16SOIC; Manufacturer: Spansion; Memory Type: FLASH - NOR; Memory Size: 1G (128M x 8); Interface: SPI Serial; Voltage - Supply: 2.7 V ~ 3.6 V; Supplier 1: Digi-Key; Manufacturer Part Number: S70FL01GSAGMFI011; RoHS: RoHS Compliant; Category: Integrated Circuits (ICs); Stock 1: 1899; Pricing 1: 1=10.35, 10=9.584, 50=9.3154, 100=8.4455 (USD); Packaging: Tube; Format - Memory: FLASH; Speed: 133MHz; Operating Temperature: -40°C ~ 85°C; Package / Case: 16-SOIC (0.295", 7.50mm Width); Supplier Device Package: 16-SOIC; ComponentLink1URL: http://www.spansion.com/Support/Datasheets/S70FL01GS.pdf; ComponentLink1Description: http://www.spansion.com/Support/Datasheets/S70FL01GS.pdf; Supplier Part Number 1: 1274-1092-ND

## Sheet karmanDB_gps&gs.SchDoc
size A
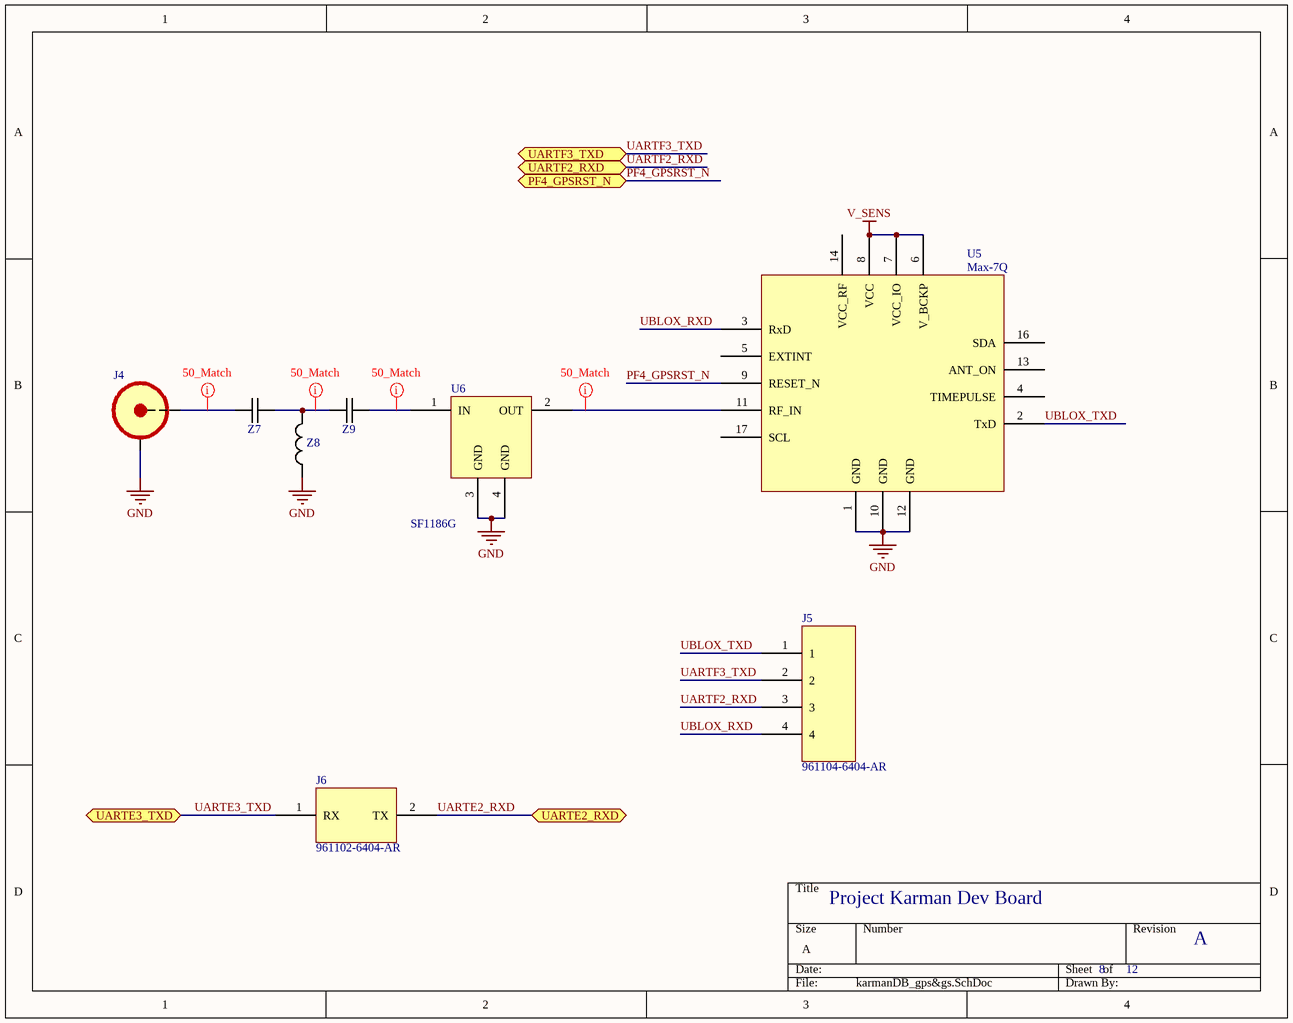
[diagram p7: karmanDB_gps&gs.SchDoc]

### Parts
J4  MOLEX_0733910060  [MOLEX_0733910060]  (value not drawn)
J5  961104-6404-AR  [961104-6404-AR]
J6  961102-6404-AR  [3M_961102-6X04]
U5  Max-7Q  [11 MAX-7Q]
U6  SF1186G  [sf1186g]
Z7  CAP_GENERIC_0402  [MURATA_GRM_0402]  (value not drawn)
Z8  IND_GENERIC_0402  [PANASONIC_ELJRF]  (value not drawn)
Z9  CAP_GENERIC_0402  [MURATA_GRM_0402]  (value not drawn)

### Ports
PF4_GPSRST_N (bidir), UARTE2_RXD (bidir), UARTE3_TXD (bidir), UARTF2_RXD (bidir), UARTF3_TXD (bidir)

### Nets
GND: J4.SHIELD U5.1(GND) U5.10(GND) U5.12(GND) U6.3(GND) U6.4(GND) Z8.1
V_SENS: U5.6(V_BCKP) U5.7(VCC_IO) U5.8(VCC)
PF4_GPSRST_N: U5.9(RESET_N) ; port PF4_GPSRST_N
UARTE2_RXD: J6.2(TX) ; port UARTE2_RXD
UARTE3_TXD: J6.1(RX) ; port UARTE3_TXD
UARTF2_RXD: J5.3 ; port UARTF2_RXD
UARTF3_TXD: J5.2 ; port UARTF3_TXD
UBLOX_RXD: J5.4 U5.3(RxD)
UBLOX_TXD: J5.1 U5.2(TxD)
NetJ4_PIN: J4.PIN Z7.1
NetU5_11: U5.11(RF_IN) U6.2(OUT)
NetU6_1: U6.1(IN) Z9.2
NetZ7_2: Z7.2 Z8.2 Z9.1

Not connected (* = marked no-connect by the designer): U5 4(TIMEPULSE) 5(EXTINT) 13(ANT_ON) 14(VCC_RF) 16(SDA) 17(SCL)

### Layout directives
net class 50_Match_Class: NetJ4_PIN, NetU5_11, NetU6_1, NetZ7_2

### Notes on the sheet
- Project Karman Dev Board
- 8
- 12
- A

### Library data of the parts
J4 = MOLEX_0733910060: CONN SMA JACK STR 50 OHM PCB; Manufacturer: Molex Inc; Connector Type: Jack, Female Socket; Contact Termination: Solder; Impedance: 50 Ohm; Frequency - Max: 18GHz; Body Material: Brass; Body Finish: Gold; Center Contact Material: Beryllium Copper; Dielectric Material: Polytetrafluoroethylene (PTFE); Voltage Rating: 500V; Supplier 1: Digi-Key; Manufacturer Part Number: 0733910060; RoHS: RoHS Compliant; Category: Connectors, Interconnects; Stock 1: 6663; Packaging: Bulk; Connector Style: SMA; Shield Termination: Solder; Mounting Type: Through Hole; Cable Group: -; Fastening Type: Threaded; Features: -; Housing Color: Gold; Ingress Protection: -; Center Contact Plating: Gold; Operating Temperature: -65°C ~ 165°C; ComponentLink1URL: http://www.molex.com/pdm_docs/sd/733910060_sd.pdf; ComponentLink1Description: http://www.molex.com/pdm_docs/sd/733910060_sd.pdf; Supplier Part Number 1: WM5543-ND; Pricing: 1=2.99, 10=2.87, 25=2.6308, 50=2.5114, 100=2.3918, 250=2.09284, 500=2.03304, 1000=1.73406, 2500=1.61446 (USD)
J5 = 961104-6404-AR: CONN HEADER VERT SGL 4POS GOLD; Manufacturer: 3M; Connector Type: Header, Unshrouded; Number of Positions: 4; Number of Positions Loaded: All; Pitch: 0.100" (2.54mm); Supplier 1: Digi-Key; Manufacturer Part Number: 961104-6404-AR; RoHS: RoHS Compliant; Category: Connectors, Interconnects; Stock 1: 17691; Pricing 1: 1=0.33, 10=0.315, 25=0.27, 50=0.2296, 100=0.2205, 250=0.198, 500=0.189, 1000=0.1575, 2500=0.144 (USD); Packaging: Bulk; Contact Type: Male Pin; Number of Rows: 1; Row Spacing: -; Contact Mating Length: 0.217" (5.50mm); Mounting Type: Through Hole; Termination: Solder; Fastening Type: -; Features: -; Contact Finish: Gold; Contact Finish Thickness: Flash; Color: Black; ComponentLink1URL: http://multimedia.3m.com/mws/mediawebserver?66666UuZjcFSLXTtNxTElX&VEVuQEcuZgVs6EVs6E666666--; ComponentLink1Description: http://multimedia.3m.com/mws/mediawebserver?66666UuZjcFSLXTtNxTElX&VEVuQEcuZgVs6EVs6E666666--; Supplier Part Number 1: 3M9449-ND
J6 = 961102-6404-AR: as J9 on sheet karmanDB_power; Supplier 1: Digi-Key; Manufacturer Part Number: 961102-6404-AR; RoHS: RoHS Compliant; Category: Connectors, Interconnects; Stock 1: 60000; Pricing 1: 1=0.16, 10=0.15, 25=0.128, 50=0.112, 100=0.104, 250=0.092, 500=0.088, 1000=0.072, 2500=0.066 (USD); Packaging: Bulk; Contact Type: Male Pin; Number of Rows: 1; Row Spacing: -; Contact Mating Length: 0.217" (5.50mm); Mounting Type: Through Hole; Termination: Solder; Fastening Type: -; Features: -; Contact Finish: Gold; Contact Finish Thickness: Flash; Color: Black; ComponentLink1URL: http://multimedia.3m.com/mws/mediawebserver?66666UuZjcFSLXTtNxTElX&VEVuQEcuZgVs6EVs6E666666--; ComponentLink1Description: http://multimedia.3m.com/mws/mediawebserver?66666UuZjcFSLXTtNxTElX&VEVuQEcuZgVs6EVs6E666666--; Supplier Part Number 1: 3M9447-ND
U5 = Max-7Q: MAX-7Q ublox GPS chip
U6 = SF1186G: SAW Filter MuRata; Supplier 1: Digi-Key; Supplier Part Number 1: 583-1198-6-ND
Z7 Z9 = CAP_GENERIC_0402: Generic Capacitor 0402 Package; Capacitance: 1000pF; Category: Capacitors; Applications: General Purpose; Size / Dimension: 0.039" L x 0.020" W (1.00mm x 0.50mm); Package / Case: 0402 (1005 Metric); Mounting Type: Surface Mount, MLCC
Z8 = IND_GENERIC_0402: Generic Inductor 0402 Package; Mounting Type: Surface Mount; Package / Case: 0402 (1005 Metric)

## Sheet karmanDB_camera.SchDoc
size A
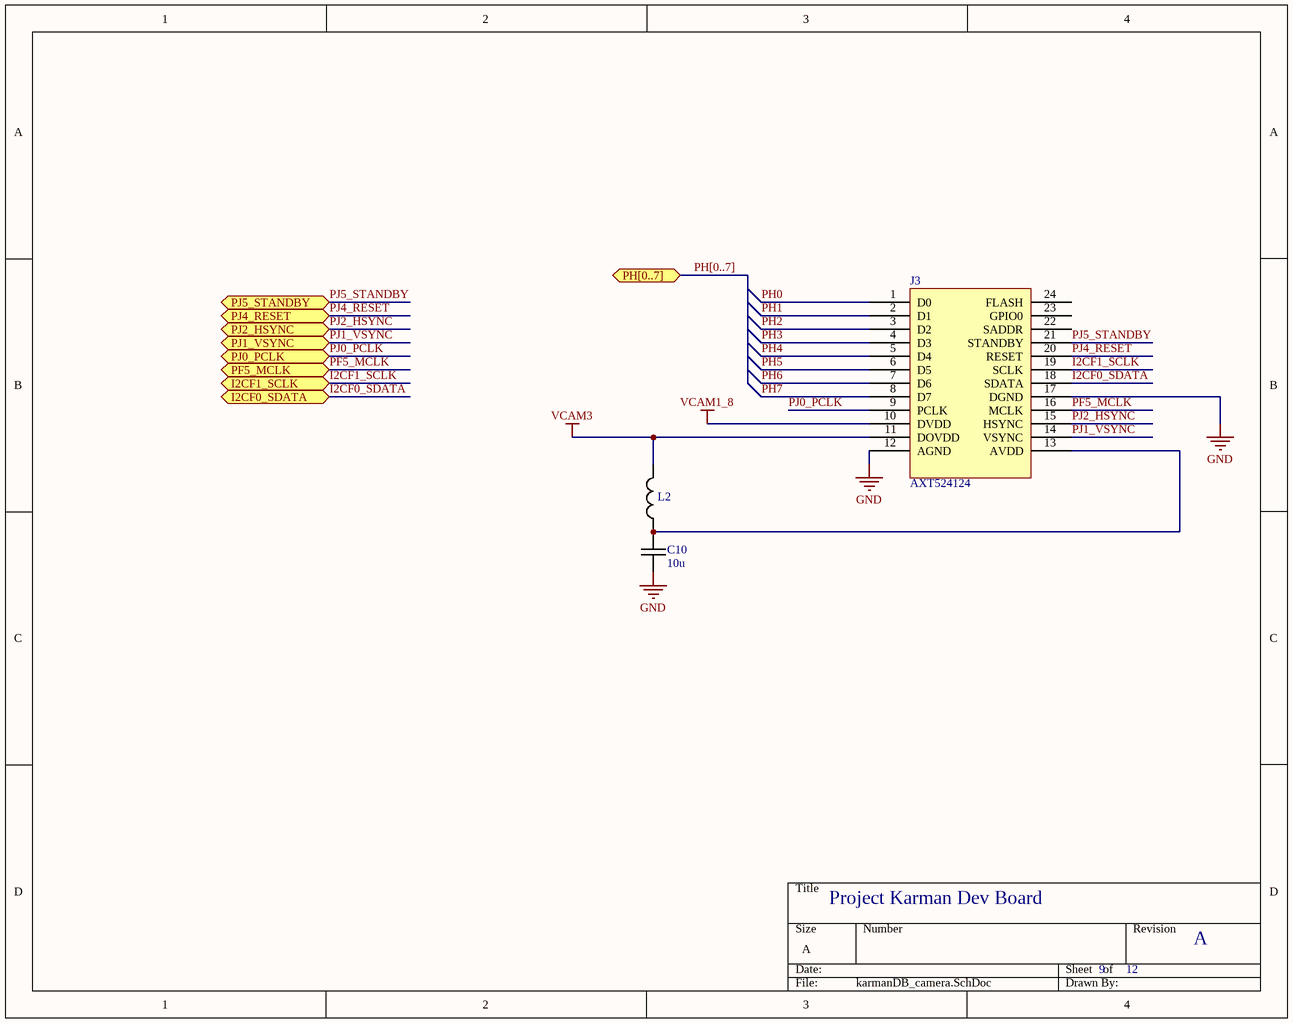
[diagram p8: karmanDB_camera.SchDoc]

### Parts
C10  10u  [MURATA_GRM_0603]
J3  AXT524124  [AXT524124]
L2  BLM15BB221SN1D  [BLM15]  (value not drawn)

### Ports
I2CF0_SDATA (bidir), I2CF1_SCLK (bidir), PF5_MCLK (bidir), PH[0..7], PJ0_PCLK (bidir), PJ1_VSYNC (bidir), PJ2_HSYNC (bidir), PJ4_RESET (bidir), PJ5_STANDBY (bidir)

### Nets
GND: C10.2 J3.12(AGND) J3.17(DGND)
VCAM1_8: J3.10(DVDD)
VCAM3: J3.11(DOVDD) L2.2
I2CF0_SDATA: J3.18(SDATA) ; port I2CF0_SDATA
I2CF1_SCLK: J3.19(SCLK) ; port I2CF1_SCLK
PF5_MCLK: J3.16(MCLK) ; port PF5_MCLK
PH0: J3.1(D0)
PH1: J3.2(D1)
PH2: J3.3(D2)
PH3: J3.4(D3)
PH4: J3.5(D4)
PH5: J3.6(D5)
PH6: J3.7(D6)
PH7: J3.8(D7)
PJ0_PCLK: J3.9(PCLK) ; port PJ0_PCLK
PJ1_VSYNC: J3.14(VSYNC) ; port PJ1_VSYNC
PJ2_HSYNC: J3.15(HSYNC) ; port PJ2_HSYNC
PJ4_RESET: J3.20(RESET) ; port PJ4_RESET
PJ5_STANDBY: J3.21(STANDBY) ; port PJ5_STANDBY
NetC10_1: C10.1 J3.13(AVDD) L2.1

Not connected (* = marked no-connect by the designer): J3 22(SADDR) 23(GPIO0) 24(FLASH)

### Buses and harness runs
bus PH[0..7] = port PH[0..7]

### Notes on the sheet
- Project Karman Dev Board
- 9
- 12
- A

### Library data of the parts
C10 = CAP_MURATA_GRM188R60J106: as C23 on sheet karmanDB_power; Supplier 1: Digi-Key; Supplier Part Number 1: 490-6405-1-ND; RoHS: RoHS Compliant; Category: Capacitors; Stock 1: 159118; Pricing: 1=0.19, 10=0.128, 50=0.0776, 100=0.0651, 250=0.05272, 500=0.0465, 1000=0.03953, 5000=0.03333 (USD); Packaging: Cut Tape (CT); Tolerance: ±20%; Voltage - Rated: 6.3V; Temperature Coefficient: X5R; Mounting Type: Surface Mount, MLCC; Operating Temperature: -55°C ~ 85°C; Applications: General Purpose; Ratings: -; Package / Case: 0603 (1608 Metric); Size / Dimension: 0.063" L x 0.031" W (1.60mm x 0.80mm); Height - Seated (Max): -; Thickness (Max): 0.035" (0.90mm); Lead Spacing: -; Features: -; Lead Style: -; ComponentLink1URL: http://www.murata.com/~/media/webrenewal/support/library/catalog/products/capacitor/mlcc/c02e.ashx; ComponentLink1Description: http://www.murata.com/~/media/webrenewal/support/library/catalog/products/capacitor/mlcc/c02e.ashx
J3 = AXT524124: CONN SOCKET F4S .4MM 24POS SMD; Manufacturer: Panasonic Electric Works; Connector Type: Socket, Outer Shroud Contacts; Number of Positions: 24; Pitch: 0.016" (0.40mm); Mated Stacking Heights: 1mm; Supplier 1: Digi-Key; Manufacturer Part Number: AXT524124; RoHS: RoHS Compliant; Category: Connectors, Interconnects; Stock 1: 1416; Pricing 1: 1=2.29, 10=1.901, 100=1.408, 250=1.2352, 500=1.1264 (USD); Packaging: Cut Tape (CT); Number of Rows: 2; Mounting Type: Surface Mount; Features: Solder Retention; Contact Finish: Gold; Contact Finish Thickness: -; Height Above Board: 0.038" (0.97mm); ComponentLink1URL: http://www3.panasonic.biz/ac/e_download/control/connector/base-fpc/catalog/con_eng_f4s.pdf; ComponentLink1Description: http://www3.panasonic.biz/ac/e_download/control/connector/base-fpc/catalog/con_eng_f4s.pdf; Supplier Part Number 1: 255-2411-1-ND
L2 = BLM15BB221SN1D: FERRITE CHIP 220 OHM 200MA 0402; Manufacturer: Murata Electronics North America; Impedance @ Frequency: 220 Ohm @ 100MHz; DC Resistance (DCR): 800 mOhm Max; Filter Type: Differential Mode - Single; Supplier 1: Digi-Key; Manufacturer Part Number: BLM15BB221SN1D; RoHS: RoHS Compliant; Category: Filters; Stock 1: 37626; Pricing 1: 1=0.1, 10=0.083, 50=0.0544, 100=0.047, 250=0.03712, 500=0.03136, 1000=0.0264, 5000=0.02351 (USD); Packaging: Cut Tape (CT); Current Rating: 200mA; Package / Case: 0402 (1005 Metric); Mounting Type: Surface Mount; Height (Max): 0.022" (0.55mm); Size / Dimension: 0.039" L x 0.020" W (1.00mm x 0.50mm); ComponentLink1URL: http://search.murata.co.jp/Ceramy/image/img/PDF/ENG/L0110S0100BLM15B.pdf; ComponentLink1Description: http://search.murata.co.jp/Ceramy/image/img/PDF/ENG/L0110S0100BLM15B.pdf; Supplier Part Number 1: 490-5190-1-ND